# Altium schematic sheet ui_lora.SchDoc: mcHF Pro Transceiver UI board
size A3; Author: Krassi Atanassov; CompanyName: MØNKA; Engineer: For radio amateurs experimentation, non-commercial use only. Thank you!; Revision: 0.8.5; SheetTotal: 13
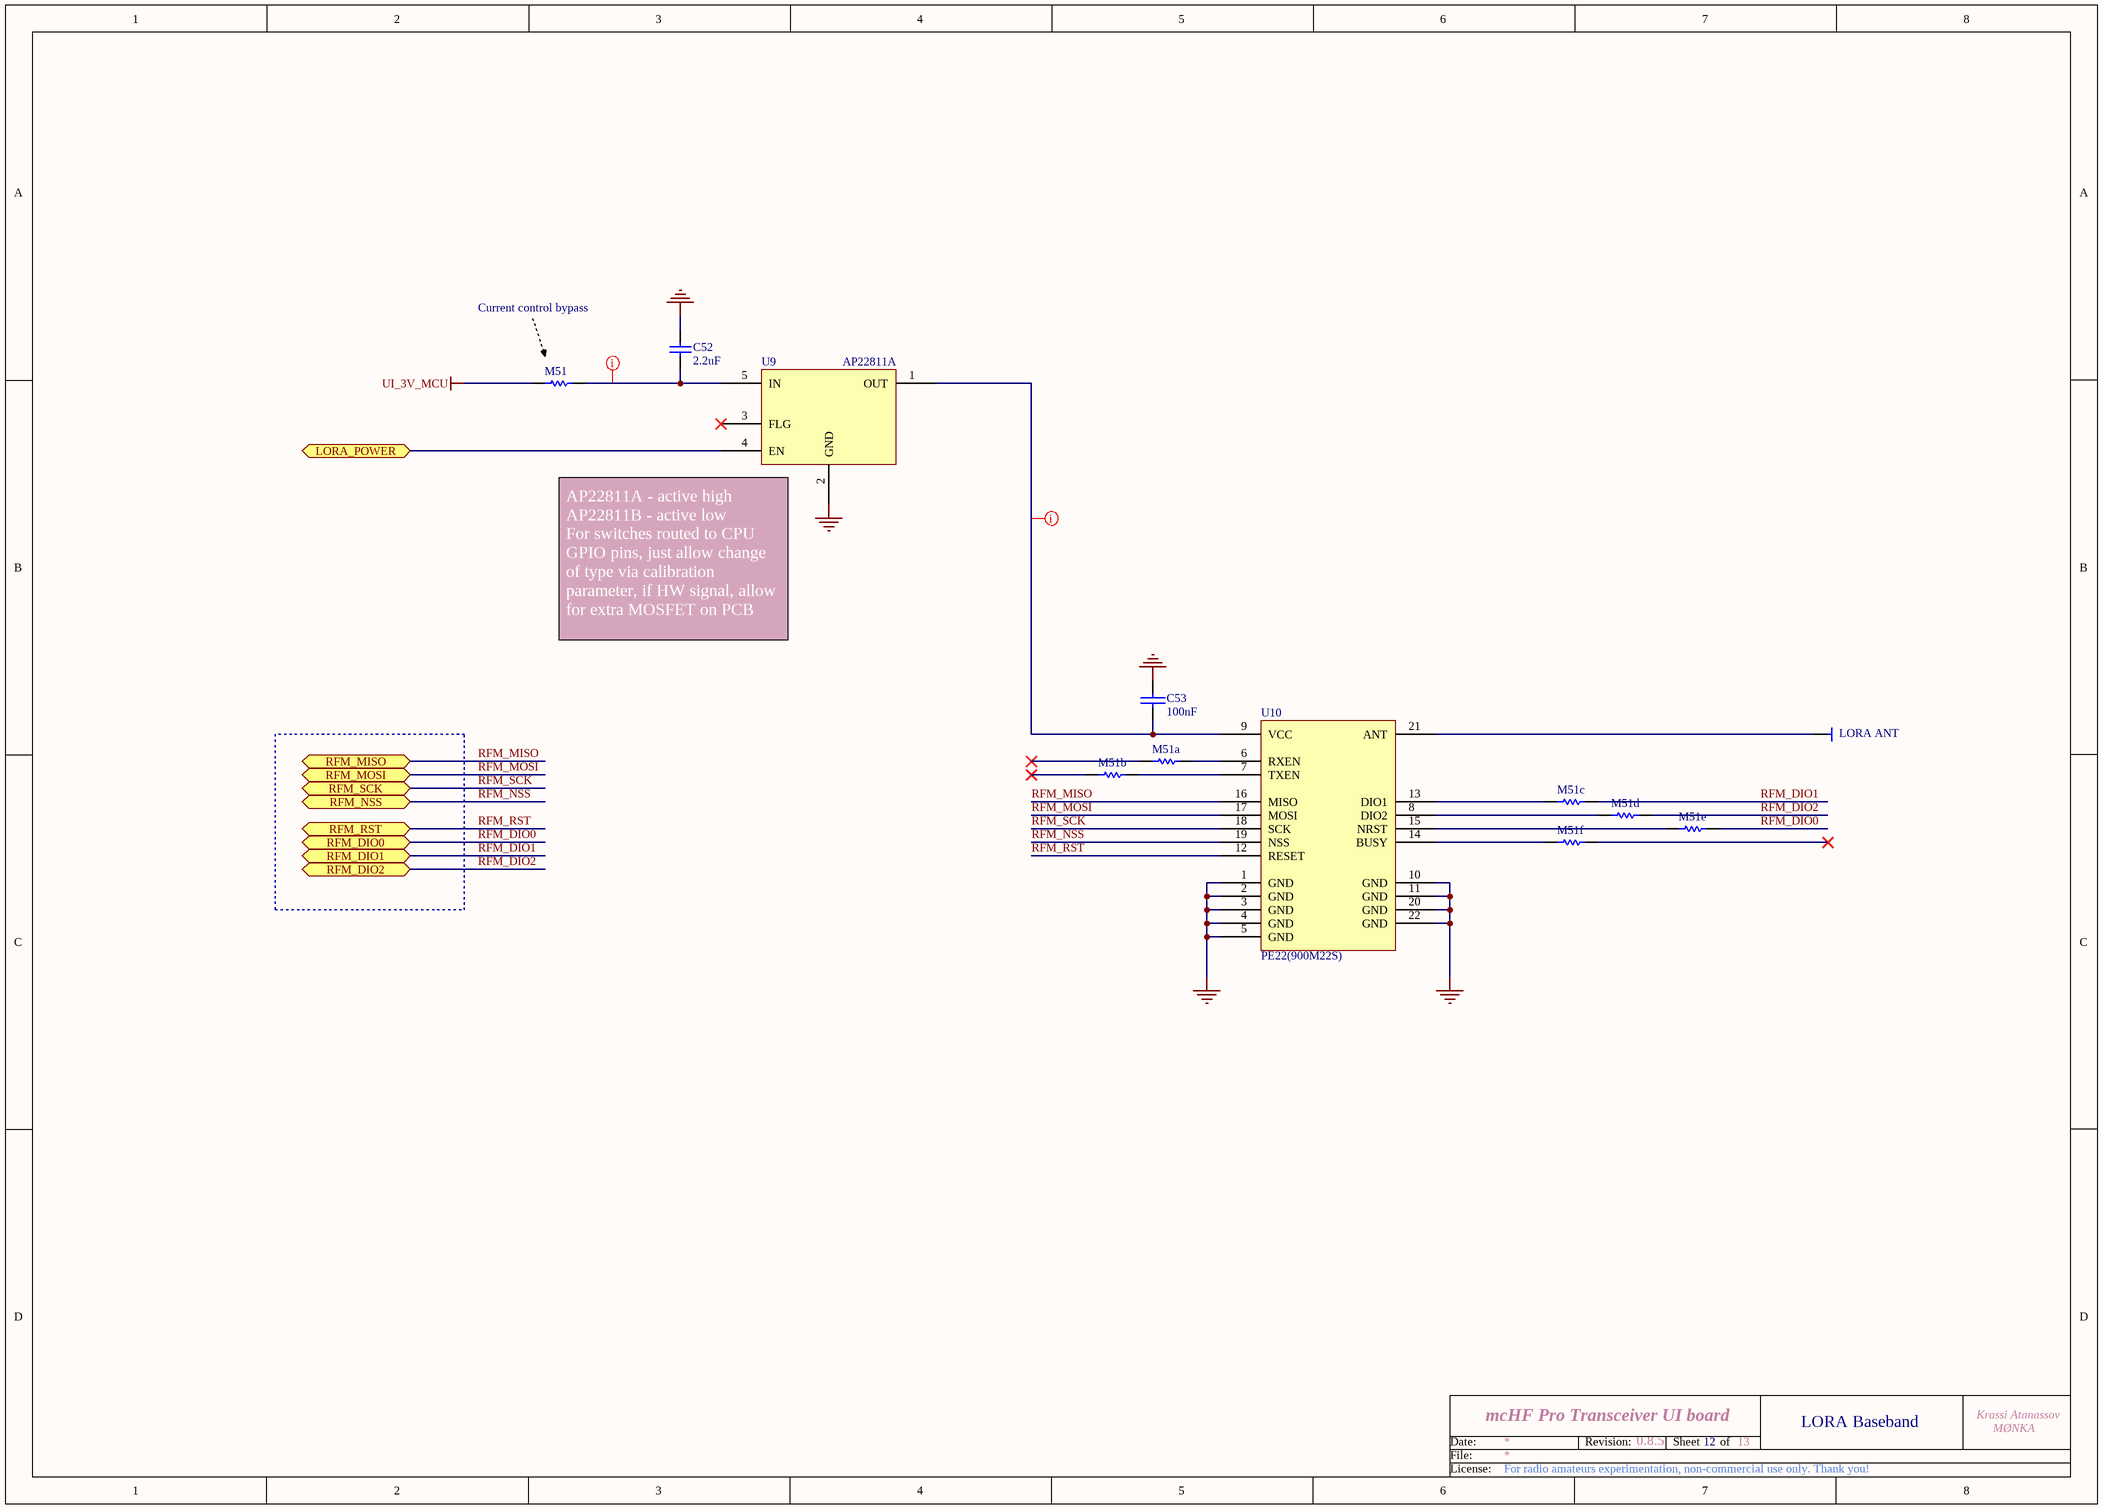
[diagram p0: ui_lora.SchDoc]

## Parts
C52  2.2uF  [0805]
C53  100nF  [0805]
LORA_ANT  TP  [lora_ant_pad]  (value not drawn)  (no BOM)
M51  0  [SB_0603]  (value not drawn)  (net tie, no BOM)
M51a  0  [SB_0603]  (value not drawn)  (net tie, no BOM)
M51b  0  [SB_0603]  (value not drawn)  (net tie, no BOM)
M51c  0  [SB_0603]  (value not drawn)  (net tie, no BOM)
M51d  0  [SB_0603]  (value not drawn)  (net tie, no BOM)
M51e  0  [SB_0603]  (value not drawn)  (net tie, no BOM)
M51f  0  [SB_0603]  (value not drawn)  (net tie, no BOM)
U9  AP22811A  [SOT25-5]
U10  PE22(900M22S)  [PE22(900M22S)]

## Ports
LORA_POWER (bidir), RFM_DIO0 (bidir), RFM_DIO1 (bidir), RFM_DIO2 (bidir), RFM_MISO (bidir), RFM_MOSI (bidir), RFM_NSS (bidir), RFM_RST (bidir), RFM_SCK (bidir)

## Nets
GND: C52.1 C53.1 U9.2(GND) U10.1(GND) U10.2(GND) U10.3(GND) U10.4(GND) U10.5(GND) U10.10(GND) U10.11(GND) U10.20(GND) U10.22(GND)
UI_3V_MCU: M51.1
LORA_POWER: U9.4(EN) ; port LORA_POWER
RFM_DIO0: M51e.2 ; port RFM_DIO0
RFM_DIO1: M51c.2 ; port RFM_DIO1
RFM_DIO2: M51d.2 ; port RFM_DIO2
RFM_MISO: U10.16(MISO) ; port RFM_MISO
RFM_MOSI: U10.17(MOSI) ; port RFM_MOSI
RFM_NSS: U10.19(NSS) ; port RFM_NSS
RFM_RST: U10.12(RESET) ; port RFM_RST
RFM_SCK: U10.18(SCK) ; port RFM_SCK
NetC52_2: C52.2 M51.2 U9.5(IN)
NetC53_2: C53.2 U9.1(OUT) U10.9(VCC)
NetLORA_ANT_1: LORA_ANT.1 U10.21(ANT)
NetM51a_2: M51a.2 U10.6(RXEN)
NetM51b_2: M51b.2 U10.7(TXEN)
NetM51c_1: M51c.1 U10.13(DIO1)
NetM51d_1: M51d.1 U10.8(DIO2)
NetM51e_1: M51e.1 U10.15(NRST)
NetM51f_1: M51f.1 U10.14(BUSY)

Not connected (* = marked no-connect by the designer): M51a 1*; M51b 1*; M51f 2*; U9 3(FLG)*

## Layout directives
rule Width Constraint [Pref Width = 12mil    Min Width = 12mil    Max Width = 12mil]: NetC52_2, NetC53_2

## Notes on the sheet
- Current control bypass
- (near U9) AP22811A - active high                                 AP22811B - active low                             For switches routed to CPU GPIO pins, just allow change of type via calibration parameter, if HW signal, allow for extra MOSFET on PCB
- 12
- LORA Baseband
- Date:
- File:
- Revision:
- Sheet
- of
- License:

## Library data of the parts
C52 = CAP SMD 0603  X5R 1礔 25V 10%: 0603  X5R 1礔; Rated voltage: 25V; Tolerance: 10%; Manufacturer: *; Manufacturer P/N: *; Order code Farnell: 1288202RL; Value: 1礔; Power: *; Technology: X5R; Temperature  Factor: *; Temperature Max: +125癈; Temperature Min: -55癈; STS Code: *
C53 = CAP: Capacitor; Order: FN 252-2090; QT Order: QCC-00154; Price: 0.068
LORA_ANT = TP: Test point
M51 M51a M51b M51c M51d M51e M51f = Link: Value: 1K; Published: 8-Jun-2000; Revision: July-2002: Re-released for DXP Platform.; Publisher: Altium Limited
U9 = AP22811: High-side switch; Order: FN 274-8550
U10 = PE22(900M22S): Lora Module